# EAGLE design rs485_usb (EAGLE 7.2.0)
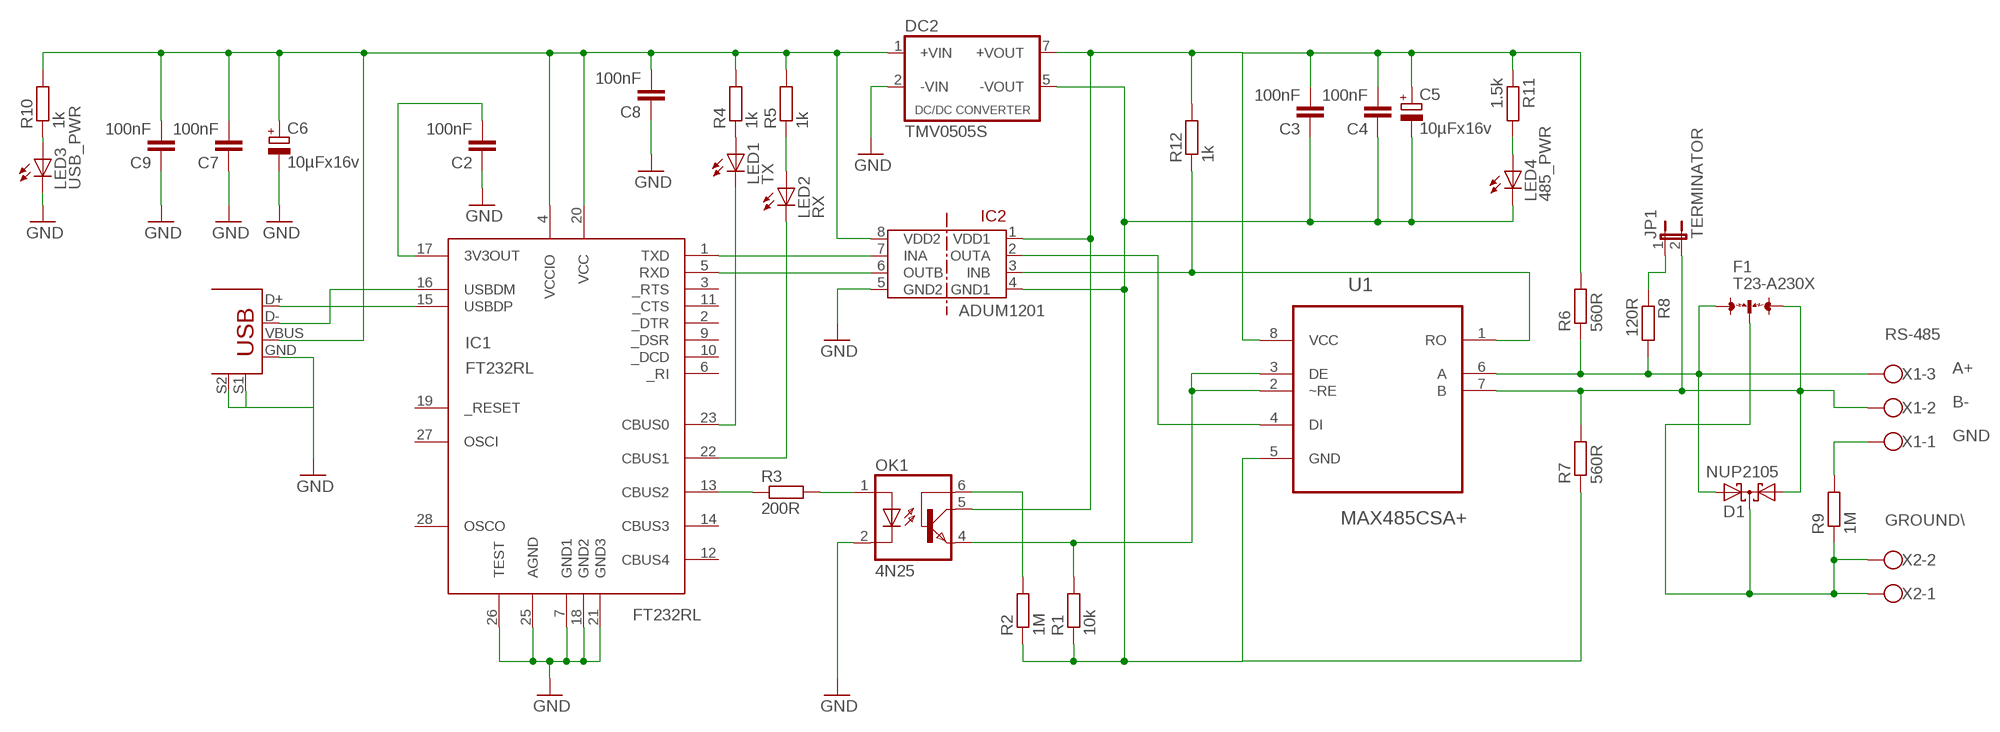
[diagram p0: schematic, sheet 1]

## Parts
C2  100nF  C-EUC0603  [C0603]
C3  100nF  C-EUC0805  [C0805]
C4  100nF  C-EUC0805  [C0805]
C5  10µFx16v  CPOL-EUE2,5-6E  [E2,5-6E]
C6  10µFx16v  CPOL-EUE2,5-6E  [E2,5-6E]
C7  100nF  C-EUC0805  [C0805]
C8  100nF  C-EUC0805  [C0805]
C9  100nF  C-EUC0805  [C0805]
D1  NUP2105  BAS70-05  [SOT23]
DC2  TMV0505S  NMKXXXXSAC  [NMKXXXXSAC]
F1  T23-A230X  [T23-A230X]
IC1  FT232RL  [SSOP28DB]
IC2  ADUM1201  [SO8]
JP1  TERMINATOR  JP1E  [JP1]
LED1  TX  LED3MM  [LED3MM]
LED2  RX  LED3MM  [LED3MM]
LED3  USB_PWR  LED3MM  [LED3MM]
LED4  485_PWR  LED3MM  [LED3MM]
OK1  4N25  4N35  [DIL06]
R1  10k  R-EU_0204/5  [0204/5]
R2  1M  R-EU_R0603  [R0603]
R3  200R  R-EU_R0603  [R0603]
R4  1k  R-EU_R0805  [R0805]
R5  1k  R-EU_R0805  [R0805]
R6  560R  R-EU_R0603  [R0603]
R7  560R  R-EU_R0603  [R0603]
R8  120R  R-EU_R0603  [R0603]
R9  1M  R-EU_0207/2V  [0207/2V]
R10  1k  R-EU_R0805  [R0805]
R11  1.5k  R-EU_R0805  [R0805]
R12  1k  R-EU_R0805  [R0805]
U1  MAX485CSA+  [SOIC127P600X175-8N]
U$1  USB+SHIELD  [USB-B-PTH]
X1  W237-103  [W237-103]
X2  W237-102  [W237-102]

## Nets
GND: C2.1 C6.- C7.1 C8.1 C9.1 DC2.2(-VIN) IC1.7(GND1) IC1.18(GND2) IC1.21(GND3) IC1.25(AGND) IC1.26(TEST) IC2.5(GND2) LED3.K(C) OK1.2(C) U$1.GND U$1.S1 U$1.S2
GROUND: D1.3(C) F1.2 R9.1 X2.1 X2.2
N$1: IC1.15(USBDP) U$1.D+
N$2: IC1.16(USBDM) U$1.D-
N$3: C6.+ C7.2 C8.2 C9.2 DC2.1(+VIN) IC1.4(VCCIO) IC1.20(VCC) IC2.8(VDD2) R4.2 R5.2 R10.2 U$1.VBUS
N$4: IC1.1(TXD) IC2.7(INA)
N$5: IC1.5(RXD) IC2.6(OUTB)
N$6: OK1.4(EMI) R1.2 U1.2(~RE) U1.3(DE)
N$7: IC2.2(OUTA) U1.4(DI)
N$8: IC2.3(INB) R12.1 U1.1(RO)
N$9: JP1.1 R8.1
N$10: C3.2 C4.2 C5.+ DC2.7(+VOUT) IC2.1(VDD1) OK1.5(COL) R6.2 R11.1 R12.2 U1.8(VCC)
N$11: OK1.6(BAS) R2.2
N$12: OK1.1(A) R3.2
N$13: IC1.13(CBUS2) R3.1
N$14: IC1.23(CBUS0) LED1.K(C)
N$15: IC1.22(CBUS1) LED2.K(C)
N$16: LED1.A R4.1
N$17: LED2.A R5.1
N$18: C2.2 IC1.17(3V3OUT)
N$19: C3.1 C4.1 C5.- DC2.5(-VOUT) IC2.4(GND1) LED4.K(C) R1.1 R2.1 R7.1 U1.5(GND)
N$20: D1.2(A2) F1.1 R6.1 R8.2 U1.6(A) X1.3
N$21: D1.1(A1) F1.3 JP1.2 R7.2 U1.7(B) X1.2
N$22: R9.2 X1.1
N$24: LED4.A R11.2
N$25: LED3.A R10.1
Unconnected: IC1.2(_DTR) IC1.3(_RTS) IC1.6(_RI) IC1.9(_DSR) IC1.10(_DCD) IC1.11(_CTS) IC1.12(CBUS4) IC1.14(CBUS3) IC1.19(_RESET) IC1.27(OSCI) IC1.28(OSCO)

## Notes on the sheet
- ADUM1201
- RS-485
- A+
- B-
- GND
- GROUND\
- FT232RL

## Library data of the parts
C2-C4 C7-C9 = rcl:C-EU: CAPACITOR, European symbol
C5 C6 = rcl:CPOL-EU: POLARIZED CAPACITOR, European symbol
D1 = diode:BAS70-05: Silicon Schottky Diodes General-purpose diode for high-speed switching
DC2 = dc-dc:NMKXXXXSAC: DC-DC CONVERTER
F1 = discrete:T23-A230X: 3-electrode arrester B88069X8740B502 Source: EPCOS .. t23a230xx8740.pdf
IC1 = ftdichip-3:FT232RL: USB UART 4th Generation USB UART (USB <-> Serial) Controller
IC2 = Bus-isolators:ADUM1201
JP1 = jumper:JP1E: JUMPER
LED1-LED4 = led:LED: LED OSRAM: - CHIPLED LG R971, LG N971, LY N971, LG Q971, LY Q971, LO R971, LY R971 LH N974, LH R974 LS Q976, LO Q976, LY Q976 LO Q996 - Hyper CHIPLED LW Q18S LB Q993, LB Q99A, LB R99A - SideLED LS A670, LO A670, LY A670, LG A670, LP A670 LB A673, LV A673, LT A673, LW A673 LH A674 LY A675 LS A676, LA A676, LO A676, LY A676, LW A676 LS A679, LY A679, LG A679 - Hyper Micro SIDELED® LS Y876, LA Y876, LO Y876, LY Y876 LT Y87S - SmartLED LW L88C, LW L88S LB L89C, LB L89S, LG L890 LS L89K, LO L89K, LY L89K LS L896, LA L896, LO L896, LY L896 - TOPLED LS T670, LO T670, LY T670, LG T670, LP T670 LSG T670, LSP T670, LSY T670, LOP T670, LYG T670 LG T671, LOG T671, LSG T671 LB T673, LV T673, LT T673, LW T673 LH T674 LS T676, LA T676, LO T676, LY T676, LB T676, LH T676, LSB T676, LW T676 LB T67C, LV T67C, LT T67C, LS T67K, LO T67K, LY T67K, LW E67C LS E67B, LA E67B, LO E67B, LY E67B, LB E67C, LV E67C, LT E67C LW T67C LS T679, LY T679, LG T679 LS T770, LO T770, LY T770, LG T770, LP T770 LB T773, LV T773, LT T773, LW T773 LH T774 LS E675, LA E675, LY E675, LS T675 LS T776, LA T776, LO T776, LY T776, LB T776 LHGB T686 LT T68C, LB T68C - Hyper Mini TOPLED® LB M676 - Mini TOPLED Santana® LG M470 LS M47K, LO M47K, LY M47K Source: http://www.osram.convergy.de LUXEON: - LUMILED® LXK2-PW12-R00, LXK2-PW12-S00, LXK2-PW14-U00, LXK2-PW14-V00 LXK2-PM12-R00, LXK2-PM12-S00, LXK2-PM14-U00 LXK2-PE12-Q00, LXK2-PE12-R00, LXK2-PE12-S00, LXK2-PE14-T00, LXK2-PE14-U00 LXK2-PB12-K00, LXK2-PB12-L00, LXK2-PB12-M00, LXK2-PB14-N00, LXK2-PB14-P00, LXK2-PB14-Q00 LXK2-PR12-L00, LXK2-PR12-M00, LXK2-PR14-Q00, LXK2-PR14-R00 LXK2-PD12-Q00, LXK2-PD12-R00, LXK2-PD12-S00 LXK2-PH12-R00, LXK2-PH12-S00 LXK2-PL12-P00, LXK2-PL12-Q00, LXK2-PL12-R00 Source: www.luxeon.com KINGBRIGHT: KA-3528ASYC Source: www.kingbright.com
OK1 = optocoupler:4N35: MOTOROLA OPTO COUPLER; MF: FAIRCHILD SEMICONDUCTOR; MPN: 4N35; OC_FARNELL: 1328375; OC_NEWARK: 72K9946
R1-R8 R10-R12 = rcl:R-EU_: RESISTOR, European symbol
R9 = resistor:R-EU_: RESISTOR, European symbol
U1 = Maxim_By_element14_Batch_1:MAX485CSA+: ±15kV ESD-Protected, Slew-Rate-Limited, Low-Power, RS-485/RS-422 Transceivers; MPN: MAX485CSA+; OC_FARNELL: 9725954; OC_NEWARK: 68K4795; PACKAGE: SOIC-8; SUPPLIER: Maxim
U$1 = SparkFun-Connectors:USB+SHIELD: USB+Shield USB connector with shield pins connectable
X1 = con-wago-500:W237-103: WAGO SCREW CLAMP; MPN: 237-103; OC_FARNELL: unknown; OC_NEWARK: 18M7116
X2 = con-wago-500:W237-102: WAGO SCREW CLAMP; MPN: 237-102; OC_FARNELL: unknown; OC_NEWARK: 70K9898

## Board
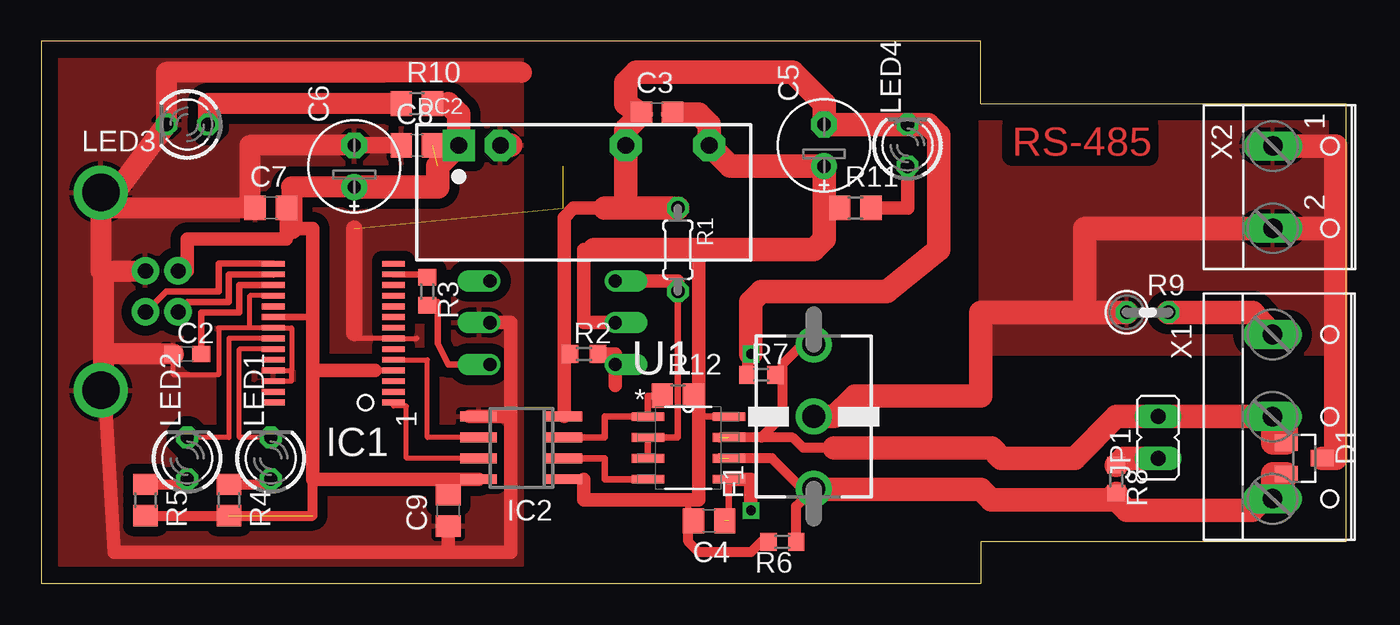
[diagram p1: board, top side]
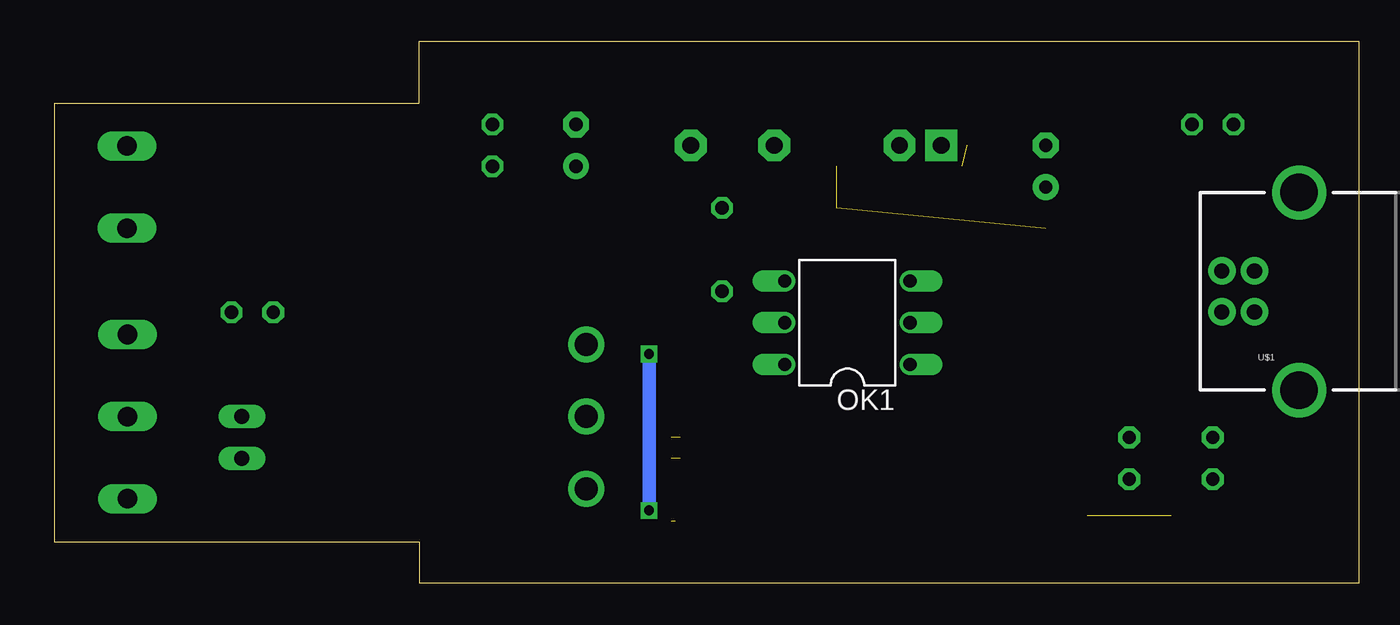
[diagram p2: board, bottom side, seen from below]

Size 79.38 x 33.02 mm. Coordinates in mm from the lower left corner, seen from the top.
Outline: 0,0 57.15,0 57.15,2.54 79.38,2.54 79.38,29.21 57.15,29.21 57.15,33.02 0,33.02 0,0
Copper layers (1*16): Top 0.035mm / dielectric 1.5mm / Bottom 0.035mm
Design rules "default": minimum track width 10mil, minimum drill 24mil, track to track 8mil, track to pad 8mil, pad to pad 8mil, via to via 8mil, smd to smd 8mil, copper to edge 40mil, drill to drill 8mil, minimum pad ring 10mil, minimum via ring 8mil, stop-mask expansion 4mil, vias tented up to drill 0mil, thermal gap 10mil

### Footprints (pad centres in the part's own frame; a part is rotated, then mirrored left to right if it is on the bottom)
C0603 = smd 1.1 x 1: 1 -0.85,0; 2 0.85,0
C0805 = smd 1.3 x 1.5: 1 -0.95,0; 2 0.95,0
E2,5-6E = drill 0.813 pad 1.575: + -1.27,0 | drill 0.813 pad 1.575 octagon: - 1.27,0
SOT23 = smd 1 x 1.4: 1 -0.95,-1.1; 2 0.95,-1.1; 3 0,1.1
NMKXXXXSAC = drill 1.016 pad 1.93 square: 1 -7.62,0 | drill 1.016 pad 1.93 octagon: 2 -5.08,0; 5 2.54,0; 7 7.62,0
T23-A230X = drill 1.4 pad 2.184: 1 -4.4,0; 2 0,0; 3 4.4,0
SSOP28DB = smd 0.348 x 1.397: 1 -4.225,-3.656; 2 -3.575,-3.656; 3 -2.925,-3.656; 4 -2.275,-3.656; 5 -1.625,-3.656; 6 -0.975,-3.656; 7 -0.325,-3.656; 8 0.325,-3.656; 9 0.975,-3.656; 10 1.625,-3.656; 11 2.275,-3.656; 12 2.925,-3.656; 13 3.575,-3.656; 14 4.225,-3.656; 15 4.225,3.656; 16 3.575,3.656; 17 2.925,3.656; 18 2.275,3.656; 19 1.625,3.656; 20 0.975,3.656; 21 0.325,3.656; 22 -0.325,3.656; 23 -0.975,3.656; 24 -1.625,3.656; 25 -2.275,3.656; 26 -2.925,3.656; 27 -3.575,3.656; 28 -4.225,3.656
SO8 = smd 0.6 x 2.2: 1 -1.905,-2.6; 2 -0.635,-2.6; 3 0.635,-2.6; 4 1.905,-2.6; 5 1.905,2.6; 6 0.635,2.6; 7 -0.635,2.6; 8 -1.905,2.6
JP1 = drill 0.914 long: 1 0,-1.27; 2 0,1.27
LED3MM = drill 0.813 octagon: A -1.27,0; K 1.27,0
DIL06 = drill 0.813 offset: 1 -2.54,-3.81; 2 0,-3.81; 3 2.54,-3.81; 4 2.54,3.81; 5 0,3.81; 6 -2.54,3.81
0204/5 = drill 0.813 octagon: 1 -2.54,0; 2 2.54,0
R0603 = smd 1 x 1.1: 1 -0.85,0; 2 0.85,0
R0805 = smd 1.3 x 1.5: 1 -0.95,0; 2 0.95,0
0207/2V = drill 0.813 octagon: 1 -1.27,0; 2 1.27,0
SOIC127P600X175-8N = smd 1.981 x 0.533: 1 -2.464,1.905; 2 -2.464,0.635; 3 -2.464,-0.635; 4 -2.464,-1.905; 5 2.464,-1.905; 6 2.464,-0.635; 7 2.464,0.635; 8 2.464,1.905
USB-B-PTH = drill 0.914 pad 1.676: D+ 0,1.25; D- 1.981,1.25; GND 0,-1.25; VBUS 1.981,-1.25 | drill 2.286: S1 -2.718,-6.02; S2 -2.718,6.02
W237-103 = drill 1.194 long: 1 -5,-1.29; 2 0,-1.29; 3 5,-1.29
W237-102 = drill 1.194 long: 1 -2.5,-1.27; 2 2.5,-1.27

### Placement (x,y rotation side)
C2  8.89,13.97 0 top
C3  37.47,28.57 0 top
C4  40.64,3.81 180 top
C5  47.62,26.67 90 top
C6  19.05,25.4 90 top
C7  13.97,22.86 0 top
C8  22.86,26.67 0 top
C9  24.76,4.45 90 top
D1  76.83,7.62 270 top
DC2  33.02,26.67 0 top
F1  46.99,10.16 90 top
IC1  17.78,15.24 90 top
IC2  29.21,8.26 90 top
JP1  67.94,8.89 0 top
LED1  13.97,7.62 90 top
LED2  8.89,7.62 90 top
LED3  8.89,27.94 180 top
LED4  52.71,26.67 90 top
OK1  31.11,15.88 90 bottom
R1  38.73,20.32 270 top
R2  33.02,13.97 0 top
R3  23.49,17.78 270 top
R4  11.43,5.08 270 top
R5  6.35,5.08 270 top
R6  45.09,2.54 180 top
R7  43.82,12.7 0 top
R8  65.41,6.35 270 top
R9  67.31,16.51 0 top
R10  22.86,29.21 0 top
R11  49.53,22.86 0 top
R12  38.73,11.43 0 top
U1  39.37,8.26 0 top
U$1  6.35,17.78 180 bottom
X1  76.2,10.16 270 top
X2  76.2,24.13 270 top

### Tracks (layer width: path | path; a pad name or v marks a point on that pad's centre or on a via)
GND  (2 unrouted)
  Top 0.305: 12.7,15.56 IC1.21 15.24,15.56 15.24,12.96 | 12.7,15.56 12.7,17.52 IC1.18 | IC1.25 15.24,12.96 | IC1.26 15.24,12.31 15.24,12.96 | 12.7,15.56 10.79,15.56 10.79,12.7 8.04,12.7 C2.1 | IC2.5 26.04,10.16 | 22.86,14.91 IC1.7 19.05,14.91 19.05,15.24
  Top 0.406: 3.81,19.03 3.63,19.03 | U$1.S2 3.81,11.76
  Top 0.813: 24.76,1.9 28.57,1.9 28.57,10.16 | 24.76,1.9 4.44,1.9 3.81,12.7 3.63,12.7 U$1.S2 | OK1.2 28.57,15.88 28.57,10.16 | 28.57,10.16 26.04,10.16 | C9.1 24.76,1.9
  Top 1.016: 19.05,15.24 19.05,21.59 | C8.1 C6.-
  Top 1.27: 12.7,22.86 3.81,22.86 | 3.81,22.86 3.63,22.86 U$1.S1 3.63,19.03 | U$1.GND 3.81,19.03 3.81,13.97 | 3.81,11.76 3.81,12.7 3.81,13.97 | C2.1 3.81,13.97 | C6.- 12.7,26.67 12.7,22.86 | 12.7,22.86 C7.1 | 3.81,22.86 LED3.K 7.62,31.12 29.21,31.12
  Top 1.422: DC2.2 28.57,26.67
  pour Top (isolate 0.61): 0,33.02 29.21,33.02 29.21,0 0,0 0,31.75
GROUND
  Top 1.422: 63.5,16.51 57.15,16.51 57.15,11.43 49.53,11.43 48.26,10.16 F1.2 | D1.3 78.74,7.62 78.74,21.59 | 78.74,21.59 74.93,21.59 X2.2 74.89,21.59 63.5,21.59 63.5,16.51 | X2.1 78.74,26.63 78.74,21.59 | R9.1 63.5,16.51
  pour Top (isolate 0.61): 57.15,29.21 80.01,29.21 80.01,13.97 57.15,13.97 57.15,27.94
N$1
  Top 0.406: U$1.D+ 6.37,16.53 7.62,17.78 10.79,17.78 10.79,19.46 IC1.15
N$2
  Top 0.406: U$1.D- 8.89,16.53 8.89,17.14 11.43,17.14 11.43,18.81 IC1.16
N$3  (2 unrouted)
  Top 0.305: IC1.4 20.32,12.96 | 16.51,12.96 16.51,12.7
  Top 0.406: IC1.20 16.51,16.21
  Top 0.61: R5.2 16.51,4.13 16.51,6.35 16.51,12.7 16.51,13.34
  Top 0.813: U$1.VBUS 8.89,19.03 8.89,20.95 14.92,20.95 14.92,21.59 | 14.92,21.59 C7.2 | 14.92,21.59 15.24,21.59 16.51,21.59 16.51,16.21 16.51,13.34 16.51,12.96 | IC2.8 24.76,6.35 | 24.76,6.35 16.51,6.35 16.51,12.96 | 20.32,12.96 16.51,12.96 | C9.2 24.76,6.35
  Top 1.27: C6.+ 15.24,24.13 15.24,21.59 | R10.2 24.76,29.21
  Top 1.422: 24.76,29.21 25.4,28.57 DC2.1 24.13,25.4 24.13,24.13 C6.+
N$4
  Top 0.305: IC2.7 22.22,7.62 22.22,10.8 21.44,10.8 IC1.1
N$5
  Top 0.305: IC2.6 23.49,8.89 23.49,13.62 IC1.5
N$6
  Top 0.406: U1.3 U1.2 38.73,8.89 R1.2
  Top 0.813: OK1.4 38.73,18.41 R1.2
N$7
  Top 0.406: U1.4 34.29,6.35 34.29,7.62 IC2.2
N$8
  Top 0.406: IC2.3 34.29,8.89 34.29,10.16 U1.1 36.91,11.43 R12.1
N$9
  Top 1.422: JP1.1 65.82,7.62 R8.1
N$10
  Top 0.406: IC2.1 33.02,6.35 | 40.01,10.16 U1.8 | C4.2 39.37,3.81 39.37,5.08 | R12.2 40.01,11.43 40.01,12.7
  Top 0.61: R6.2 43.82,2.54 43.18,1.9 40.01,1.9 39.37,2.54 39.37,3.49 C4.2
  Top 0.813: OK1.5 33.02,15.88 33.02,20.32 33.66,20.32 40.01,20.32 40.01,12.7 40.01,10.16 40.01,5.08 39.37,5.08 33.02,5.08 33.02,6.35 | R11.1 47.62,22.86
  Top 1.422: C3.2 40.01,28.57 40.64,27.94 DC2.7 41.91,25.4 C5.+ 47.62,22.86 47.62,20.95 46.99,20.32 33.66,20.32
N$11
  Top 0.813: R2.2 34.93,13.97 OK1.6 34.93,12.06
N$12
  Top 0.406: OK1.1 24.76,13.34 24.13,14.6 24.13,17.14 23.71,17.14 R3.2
N$13
  Top 0.406: IC1.13 23.31,18.81 R3.1
N$14
  Top 0.305: LED1.K 12.06,8.89 12.06,14.27 IC1.23
N$15
  Top 0.305: IC1.22 11.43,14.91 11.43,8.89 LED2.K
N$16
  Top 0.61: R4.1 13.97,6.03 LED1.A
N$17
  Top 0.61: R5.1 8.89,6.03 LED2.A
N$18
  Top 0.406: IC1.17 12.06,18.16 12.06,16.51 9.74,16.51 C2.2
N$19  (via drill 0.6)  (1 unrouted)
  Top 0.406: 41.91,3.81 41.83,3.81 U1.5
  Top 0.61: R7.1 42.97,13.76 v43.18,13.97
  Top 0.813: 31.81,13.97 31.81,22.28 32.39,22.86 36.83,22.86 | 31.81,13.97 31.81,12.06 IC2.4 | R2.1 31.81,13.97 | U1.5 43.18,6.35 v43.18,4.45
  Top 1.422: R1.1 36.83,22.86 35.56,22.86 | 35.56,22.86 34.29,22.86 | v43.18,13.97 43.18,17.14 43.82,17.78 51.44,17.78 54.61,20.32 54.61,27.3 53.98,27.94 LED4.K C5.- 47.62,29.21 45.72,31.12 36.2,31.12 35.56,30.48 35.56,29.21 C3.1 35.56,27.62 DC2.5 35.56,22.86
  Bottom 0.813: v43.18,4.45 v43.18,13.97
N$20  (1 unrouted)
  Top 0.61: 47.04,5.71 F1.1 | F1.1 46.31,5.76 44.45,7.62 41.28,7.62 | R6.1 45.94,4.7 F1.1
  Top 1.422: X1.3 74.91,6.67 D1.2 75.73,6.52 73.66,4.45 66.04,4.45 65.41,5.08 R8.2 64.98,5.08 57.79,5.08 57.15,5.71 47.04,5.71
N$21  (1 unrouted)
  Top 0.61: 48.26,8.26 46.36,8.26 45.72,8.89 43.82,8.89 | 43.82,8.89 41.28,8.89 | F1.3 46.31,14.56 45.09,13.34 45.09,12.7 | 45.09,12.7 45.09,10.16 43.82,8.89 | R7.2 45.09,12.7
  Top 1.422: 74.91,10.14 X1.2 | 74.93,10.16 75.73,9.35 D1.1 74.91,8.57 74.91,10.14 | 74.93,10.16 JP1.2 65.41,10.16 62.87,7.62 58.42,7.62 57.79,8.26 48.26,8.26 | 74.91,10.14 74.93,10.16
N$22
  Top 1.422: 74.93,15.24 74.93,15.16 X1.1 73.72,16.51 R9.2
N$24
  Top 0.813: R11.2 52.71,22.86 LED4.A
N$25
  Top 1.27: R10.1 10.16,29.21 LED3.A

### Text on the board
Top: RS-485